# EAGLE design MiniAdd-OnV11 (EAGLE 6.3)
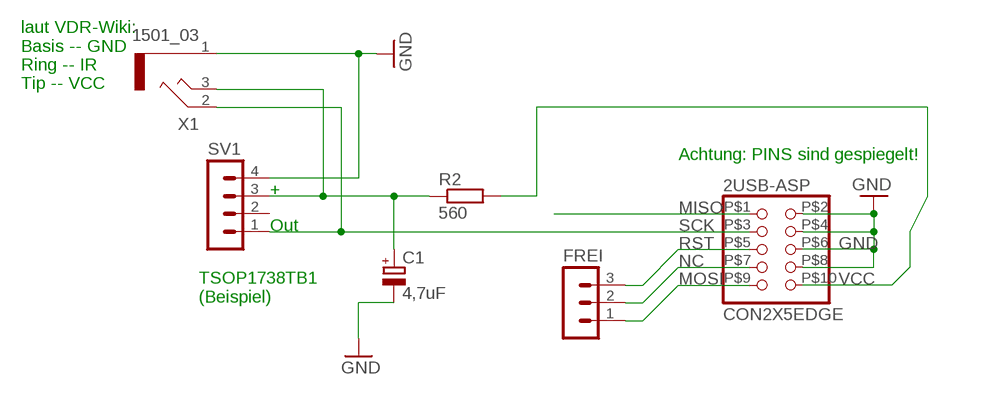
[diagram p0: schematic, sheet 1]

## Parts
2USB-ASP  CON2X5EDGE  [CON2X5EDGE]
C1  4,7uF  CPOL-EUE1.8-4  [E1,8-4]
FREI  MA03-1  [MA03-1]
R2  560  R-EU_0204/2V  [0204V]
SV1  MA04-1  [MA04-1]
X1  1501_03  [1501_03]

## Nets
GND: 2USB-ASP.P$2 2USB-ASP.P$4 2USB-ASP.P$6 2USB-ASP.P$8 C1.- SV1.4 X1.1
MISO: 2USB-ASP.P$1
MOSI: 2USB-ASP.P$9 FREI.1
N$1: C1.+ R2.1 SV1.3 X1.3
NC: 2USB-ASP.P$7 FREI.2
RST: 2USB-ASP.P$5 FREI.3
SCK: 2USB-ASP.P$3 SV1.1 X1.2
VCC: 2USB-ASP.P$10 R2.2
Unconnected: SV1.2

## Notes on the sheet
- laut VDR-Wiki:
  Basis -- GND
  Ring -- IR
  Tip -- VCC
- Achtung: PINS sind gespiegelt!
- +
- Out
- TSOP1738TB1
  (Beispiel)

## Library data of the parts
2USB-ASP = schwen:CON2X5EDGE
C1 = rcl:CPOL-EU: POLARIZED CAPACITOR, European symbol
FREI = con-lstb:MA03-1: PIN HEADER; OC_FARNELL: unknown; OC_NEWARK: unknown
R2 = rcl:R-EU_: RESISTOR, European symbol
SV1 = con-lstb:MA04-1: PIN HEADER; OC_FARNELL: unknown; OC_NEWARK: unknown
X1 = con-lumberg:1501_03: Klinkensteckverbinder nach JISC 6560, 2,5 mm Jack connectors according to JISC 6560, 2.5 mm Source: http://www.lumberg.com/Produkte/PDFs/1501_03.pdf; OC_FARNELL: 1200127; OC_NEWARK: unknown

## Net classes
0 default: width 0.406 mm

## Board
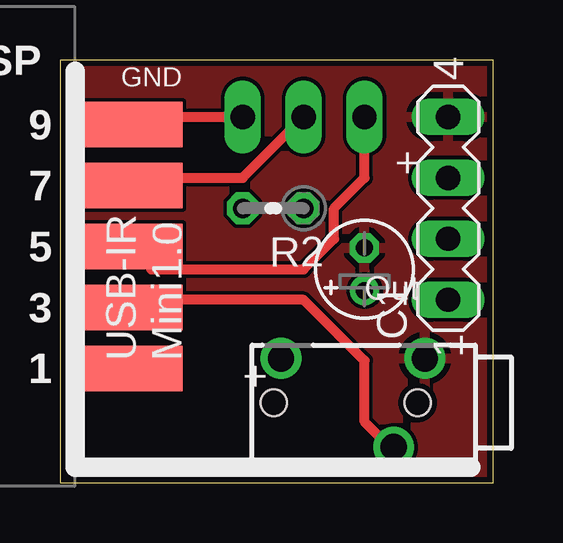
[diagram p1: board, top side]
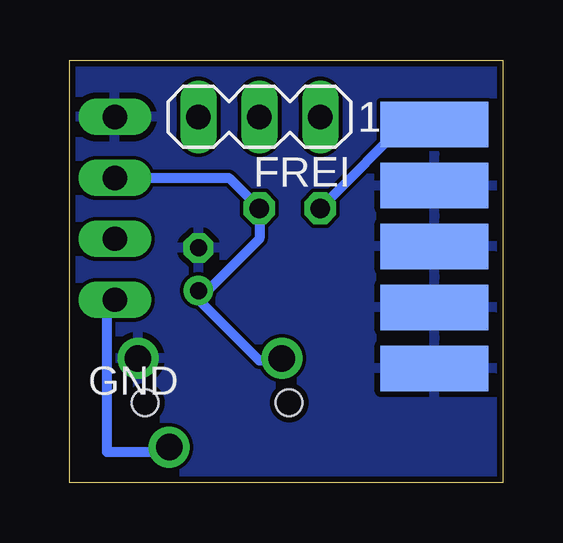
[diagram p2: board, bottom side, seen from below]

Size 18.08 x 17.61 mm. Coordinates in mm from the lower left corner, seen from the top.
Outline: 0,0 18.08,0 18.08,17.61 0,17.61 0,0
Copper layers (1*16): Top 0.035mm / dielectric 1.5mm / Bottom 0.035mm
Design rules "Fusion_eagle_rule_v1.1": minimum track width 6mil, minimum drill 12mil, track to track 6mil, track to pad 6mil, pad to pad 6mil, via to via 6mil, smd to smd 0mil, copper to edge 10mil, drill to drill 10mil, minimum pad ring 10mil, minimum via ring 6mil, stop-mask expansion 2mil, vias tented up to drill 100mil, thermal gap 10mil

### Footprints (pad centres in the part's own frame; a part is rotated, then mirrored left to right if it is on the bottom)
CON2X5EDGE = smd 4.5 x 1.9: P$1 0,5.08; P$3 0,2.54; P$5 0,0; P$7 0,-2.54; P$9 0,-5.08 | smd 4.5 x 1.9 bottom: P$2 0,5.08; P$4 0,2.54; P$6 0,0; P$8 0,-2.54; P$10 0,-5.08
E1,8-4 = drill 0.711 pad 1.168: + -0.889,0 | drill 0.711 pad 1.168 octagon: - 0.889,0
MA03-1 = drill 1.016 long: 1 -2.54,0; 2 0,0; 3 2.54,0
0204V = drill 0.813 octagon: 1 -1.27,0; 2 1.27,0
MA04-1 = drill 1.016 long: 1 -3.81,0; 2 -1.27,0; 3 1.27,0; 4 3.81,0
1501_03 = drill 1.1 pad 1.7: 1 -1.85,0.3; 2 1.85,-1; 3 -1.85,-5.7 | hole 1.1: 0,0; 0,-6

### Placement (x,y rotation side)
2USB-ASP  2.86,9.84 180 top
C1  12.7,8.89 90 top
FREI  10.16,15.24 180 bottom
R2  8.89,11.43 180 top
SV1  16.19,11.43 90 top
X1  14.92,3.33 270 top

### Tracks (layer width: path | path; a pad name or v marks a point on that pad's centre or on a via)
GND
  pour Bottom: 0,17.78 0,0 17.94,0 17.94,17.78
  pour Top: 0,17.78 17.94,17.78 17.94,0 0,0
MOSI
  Top 0.406: FREI.1 3.81,15.24 2USB-ASP.P$9
N$1
  Bottom 0.406: 12.7,7.62 10.16,5.08 8.89,5.08 X1.3 | 12.7,7.62 C1.+ 12.7,7.62 | SV1.3 15.24,12.7 11.43,12.7 R2.1 10.16,10.16 12.7,7.62
NC
  Top 0.406: FREI.2 7.62,12.7 3.81,12.7 2USB-ASP.P$7
RST
  Top 0.406: FREI.3 12.7,12.7 11.43,11.43 11.43,10.16 10.16,8.89 3.81,8.89 3.81,10.16 2USB-ASP.P$5
SCK
  Top 0.406: 2USB-ASP.P$3 3.81,7.62 10.16,7.62 12.7,5.08 12.7,2.54 13.97,1.27 X1.2
  Bottom 0.406: SV1.1 16.51,7.62 16.51,1.27 13.97,1.27 X1.2
VCC
  Bottom 0.406: R2.2 3.81,15.24 2USB-ASP.P$10

### Text on the board
tNames: GND | + | Out | USB-IR / Mini1.0 | +
bNames: GND